# Altium schematic sheet p08_boot.SchDoc
size A
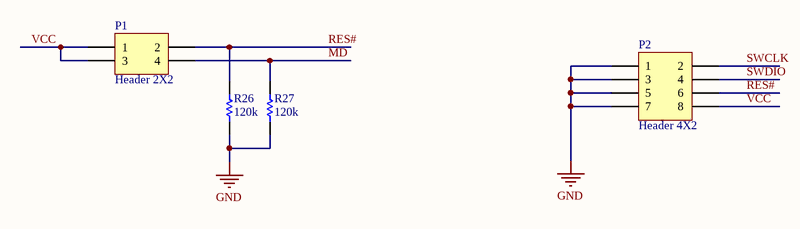
[diagram p0: p08_boot.SchDoc]

## Parts
P1  Header 2X2  [HDR2X2]
P2  Header 4X2  [HDR2X4]
R26  value 120k  [6-0805_M]  (hidden comment: Res1)
R27  value 120k  [6-0805_M]  (hidden comment: Res1)

## Nets
GND: P2.1 P2.3 P2.5 P2.7 R26.2 R27.2
MD: P1.4 R27.1
RES#: P1.2 P2.6 R26.1
SWCLK: P2.2
SWDIO: P2.4
VCC: P1.1 P1.3 P2.8

## Library data of the parts
P1 = Header 2X2: Header, 2-Pin, Dual row; LatestRevisionDate: 17-Jul-2002; LatestRevisionNote: Re-released for DXP Platform.; Publisher: Altium Limited
P2 = Header 4X2: Header, 4-Pin, Dual row; LatestRevisionDate: 17-Jul-2002; LatestRevisionNote: Re-released for DXP Platform.; Publisher: Altium Limited
R26 R27 = Res1: Resistor; Published: 8-Jun-2000; LatestRevisionDate: 17-Jul-2002; LatestRevisionNote: Re-released for DXP Platform.; PackageReference: AXIAL-0.3; Publisher: Altium Limited; PackageDescription: Axial Device, Thru-Hole; 2 Leads; 0.3 in Pin Spacing